# Altium project TK90X.PrjPcb
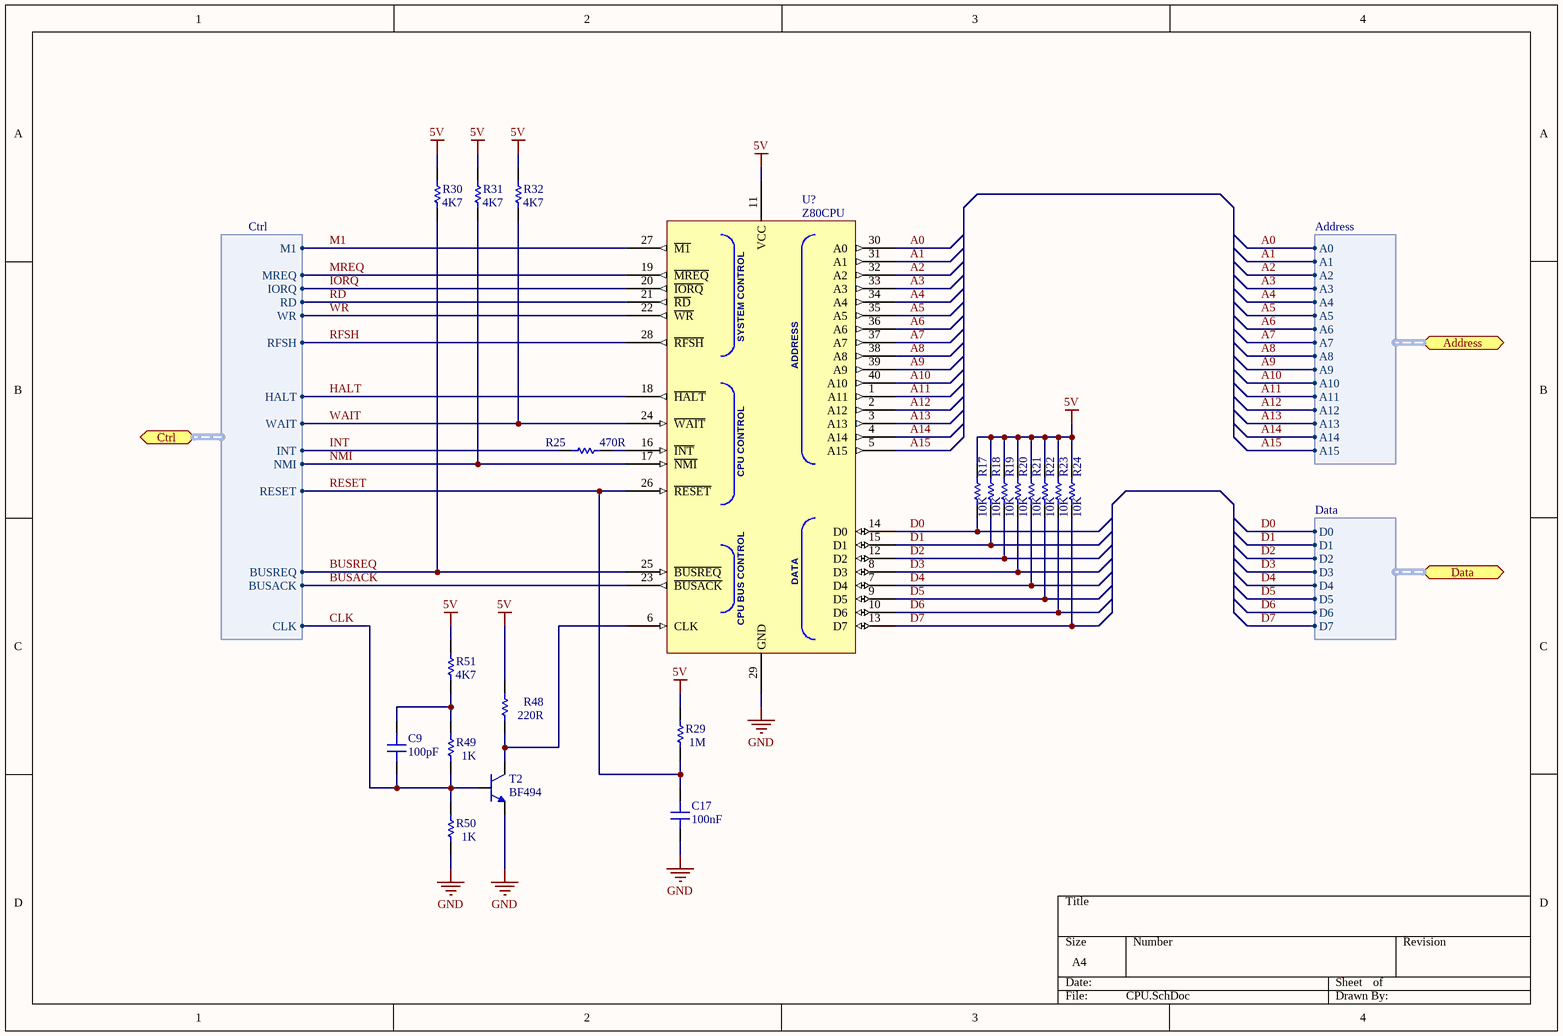
[diagram p0: CPU.SchDoc]
7 sheets, 62 parts. Net scope: flat (ports and power ports of the same name join across sheets).
Sheets:
  CPU.SchDoc
  Fonte.SchDoc
  RAM.SchDoc
  ROM.SchDoc
  ULA.SchDoc
  Video.SchDoc
  MuxAddr_RAM.SchDoc

## Sheet CPU.SchDoc
size A4

### Parts
C9  100pF  [DiskCapacitor]
C17  100nF  [DiskCapacitor]
R17  10K  [CR25]
R18  10K  [CR25]
R19  10K  [CR25]
R20  10K  [CR25]
R21  10K  [CR25]
R22  10K  [CR25]
R23  10K  [CR25]
R24  10K  [CR25]
R25  470R  [CR25]
R29  1M  [CR25]
R30  4K7  [CR25]
R31  4K7  [CR25]
R32  4K7  [CR25]
R48  220R  [CR25]
R49  1K  [CR25]
R50  1K  [CR25]
R51  4K7  [CR25]
T2  BF494  [TO-92]
U?  Z80CPU  [Z84C00xxPEG]

### Ports
Address (harness Address), Ctrl (harness Ctrl), Data (harness Data)

### Harnesses
Ctrl: M1, MREQ, IORQ, RD, WR, RFSH, HALT, WAIT, INT, NMI, RESET, BUSREQ, BUSACK, CLK
Address: A0, A1, A2, A3, A4, A5, A6, A7, A8, A9, A10, A11, A12, A13, A14, A15
Data: D0, D1, D2, D3, D4, D5, D6, D7

### Nets
5V: R17.2 R18.2 R19.2 R20.2 R21.2 R22.2 R23.2 R24.2 R29.2 R30.2 R31.2 R32.2 R48.2 R51.2 U?.11(VCC)
GND: C17.1 R50.1 T2.2 U?.29(GND)
A0: U?.30(A0) ; port Address.A0
A1: U?.31(A1) ; port Address.A1
A2: U?.32(A2) ; port Address.A2
A3: U?.33(A3) ; port Address.A3
A4: U?.34(A4) ; port Address.A4
A5: U?.35(A5) ; port Address.A5
A6: U?.36(A6) ; port Address.A6
A7: U?.37(A7) ; port Address.A7
A8: U?.38(A8) ; port Address.A8
A9: U?.39(A9) ; port Address.A9
A10: U?.40(A10) ; port Address.A10
A11: U?.1(A11) ; port Address.A11
A12: U?.2(A12) ; port Address.A12
A13: U?.3(A13) ; port Address.A13
A14: U?.4(A14) ; port Address.A14
A15: U?.5(A15) ; port Address.A15
BUSACK: U?.23(~{BUSACK}) ; port Ctrl.BUSACK
BUSREQ: R30.1 U?.25(~{BUSREQ}) ; port Ctrl.BUSREQ
CLK: C9.1 R49.1 R50.2 T2.1 ; port Ctrl.CLK
D0: R17.1 U?.14(D0) ; port Data.D0
D1: R18.1 U?.15(D1) ; port Data.D1
D2: R19.1 U?.12(D2) ; port Data.D2
D3: R20.1 U?.8(D3) ; port Data.D3
D4: R21.1 U?.7(D4) ; port Data.D4
D5: R22.1 U?.9(D5) ; port Data.D5
D6: R23.1 U?.10(D6) ; port Data.D6
D7: R24.1 U?.13(D7) ; port Data.D7
HALT: U?.18(~{HALT}) ; port Ctrl.HALT
INT: R25.1 ; port Ctrl.INT
IORQ: U?.20(~{IORQ}) ; port Ctrl.IORQ
M1: U?.27(~{M1}) ; port Ctrl.M1
MREQ: U?.19(~{MREQ}) ; port Ctrl.MREQ
NMI: R31.1 U?.17(~{NMI}) ; port Ctrl.NMI
RD: U?.21(~{RD}) ; port Ctrl.RD
RESET: C17.2 R29.1 U?.26(~{RESET}) ; port Ctrl.RESET
RFSH: U?.28(~{RFSH}) ; port Ctrl.RFSH
WAIT: R32.1 U?.24(~{WAIT}) ; port Ctrl.WAIT
WR: U?.22(~{WR}) ; port Ctrl.WR
NetC9_2: C9.2 R49.2 R51.1
NetR25_2: R25.2 U?.16(~{INT})
NetR48_1: R48.1 T2.3 U?.6(CLK)

### Notes on the sheet
- (in symbol Z84C00xxPEG) SYSTEM CONTROL; ADDRESS; CPU CONTROL; DATA; CPU BUS CONTROL

### Library data of the parts
C9 C17 = Capacitor
R17-R25 R29-R32 R48-R51 = Resistor
T2 = BF494: NPN Medium Frequency Transistors
U? = Z84C00xxPEG: Z80 - CPU

## Sheet Fonte.SchDoc
size A4
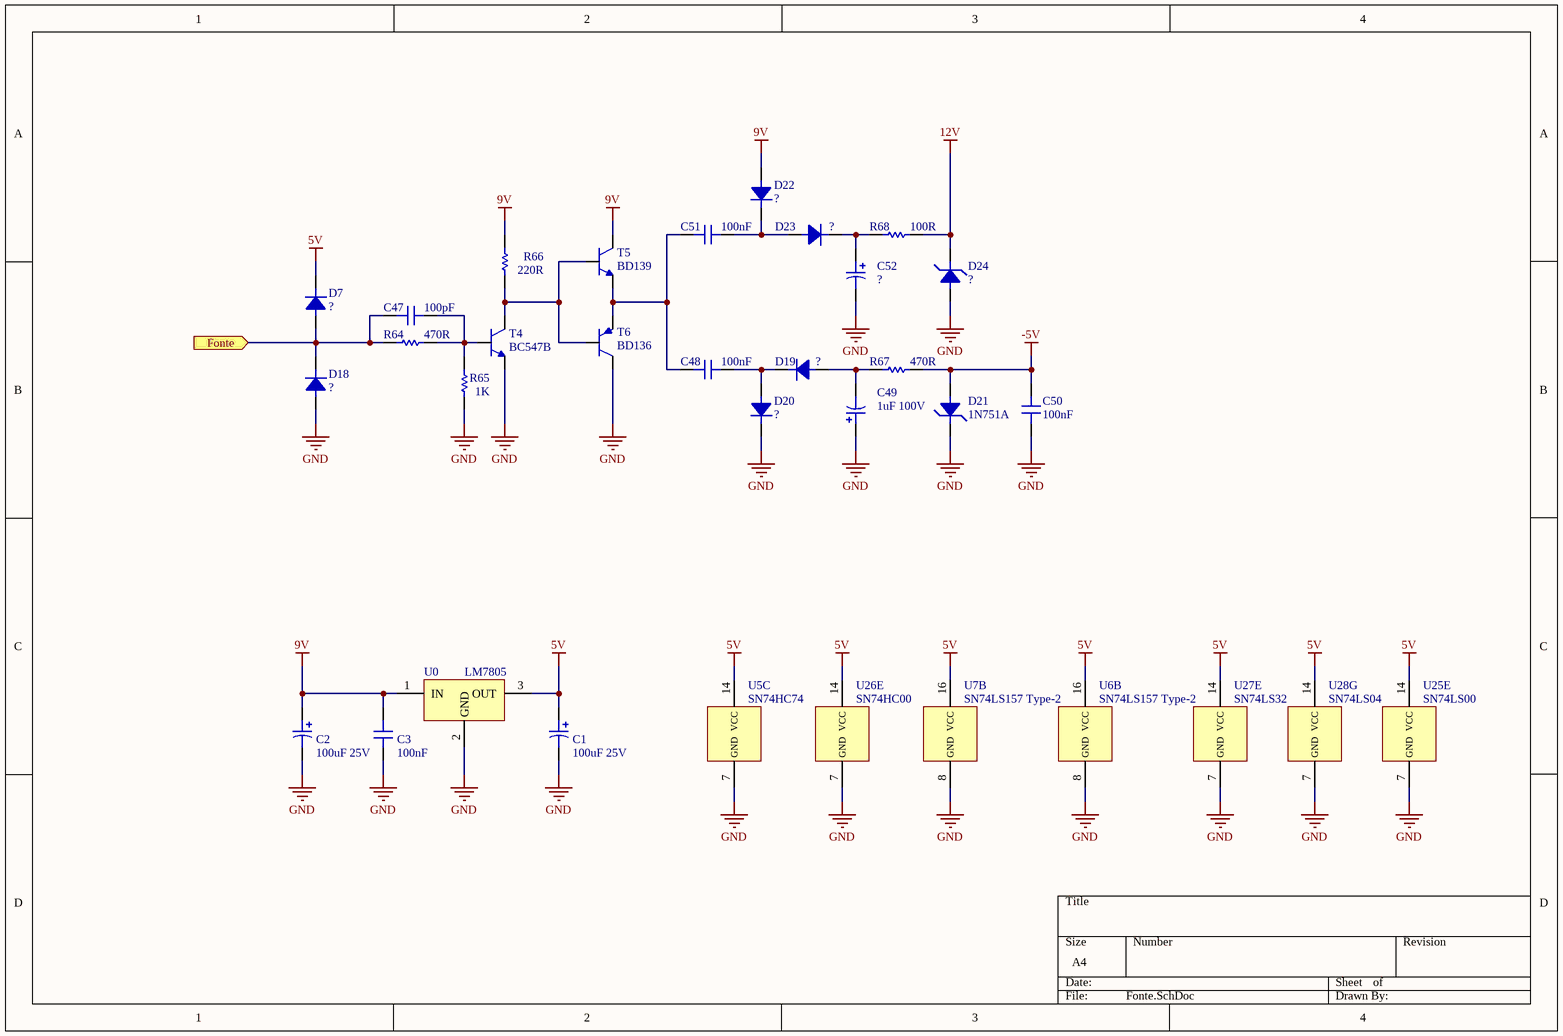
[diagram p1: Fonte.SchDoc]

### Parts
C1  100uF 25V  [ECA 6.3x11.2]
C2  100uF 25V  [ECA 6.3x11.2]
C3  100nF  [DiskCapacitor]
C47  100pF  [DiskCapacitor]
C48  100nF  [DiskCapacitor]
C49  1uF 100V  [ECA 5x11]
C50  100nF  [DiskCapacitor]
C51  100nF  [DiskCapacitor]
C52  ?  [ECA 5x11]
D7  ?  [DO-15]
D18  ?  [DO-15]
D19  ?  [DO-15]
D20  ?  [DO-15]
D21  1N751A  [DO-15]
D22  ?  [DO-15]
D23  ?  [DO-15]
D24  ?  [DO-15]
R64  470R  [CR25]
R65  1K  [CR25]
R66  220R  [CR25]
R67  470R  [CR25]
R68  100R  [CR25]
T4  BC547B  [TO-92]
T5  BD139  [TO-126]
T6  BD136  [TO-126]
U0  LM7805  [TO-220]
U5  SN74HC74  [TSSOP14]  (part C of 3)
U6  SN74LS157 Type-2  [TSSOP16]  (part B of 2)
U7  SN74LS157 Type-2  [TSSOP16]  (part B of 2)
U25  SN74LS00  [TSSOP14]  (part E of 5)
U26  SN74HC00  [TSSOP14]  (part E of 5)
U27  SN74LS32  [TSSOP14]  (part E of 5)
U28  SN74LS04  [CDIP14]  (part G of 7)

### Ports
Fonte (in)

### Nets
5V: C1.1 D7.1 U0.3(OUT) U5.14(VCC) U6.16(VCC) U7.16(VCC) U25.14(VCC) U26.14(VCC) U27.14(VCC) U28.14(VCC)
9V: C2.1 C3.2 D22.2 R66.2 T5.2 U0.1(IN)
12V: D24.1 R68.1
-5V: C50.1 D21.2 R67.1
GND: C1.2 C2.2 C3.1 C49.1 C50.2 C52.2 D18.2 D20.1 D21.1 D24.2 R65.1 T4.1 T6.2 U0.2(GND) U5.7(GND) U6.8(GND) U7.8(GND) U25.7(GND) U26.7(GND) U27.7(GND) U28.7(GND)
NetC47_1: C47.1 R64.1 R65.2 T4.2
NetC47_2: C47.2 D7.2 D18.1 R64.2 ; port Fonte
NetC48_1: C48.1 D19.1 D20.2
NetC48_2: C48.2 C51.2 T5.1 T6.1
NetC49_2: C49.2 D19.2 R67.2
NetC51_1: C51.1 D22.1 D23.2
NetC52_1: C52.1 D23.1 R68.2
NetR66_1: R66.1 T4.3 T5.3 T6.3

### Library data of the parts
C1 C2 = ECA1EM101
C3 C47 C48 C50 C51 = Capacitor
C49 = ECA2AM2R2
C52 = ECA1CM100
D7 D18-D20 D22 D23 = Diode
D21 = Diode Zener: 5V1 500mW
D24 = Diode Zener
R64-R68 = Resistor
T4 = BC546_47_48_49_50: NPN Epitaxial Silicon Transistor
T5 = BD135_37_39: NPN Epitaxial Silicon Transistor
T6 = BD136_38_40: PNP Epitaxial Silicon Transistor
U0 = LM7805: LM7805 - Positive Voltage Regulator
U5 = SN74HC74: Dual D-Type Positive-Edge-Triggered Flip-Flops With Clear and Preset
U6 U7 = SN74HC157 Type-2: Quadruple 2-Line To 1-Line Data Selectors/Mutiplexers
U25 U26 = SN74HC00: Quadruple 2-Input Positive-NAND Gates
U27 = SN74HC32: Quadruple 2-Input Positive-OR Gates
U28 = SN74HC04: Hex Inverters

## Sheet RAM.SchDoc
size A4

## Sheet ROM.SchDoc
size A4

## Sheet ULA.SchDoc
size A4
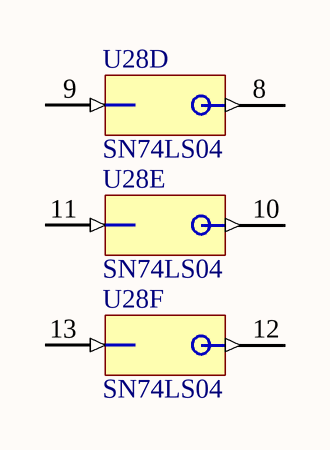
[diagram p2: ULA.SchDoc]

### Parts
U28  SN74LS04  [CDIP14]  (parts D,E,F of 7)

### Nets

Not connected (* = marked no-connect by the designer): U28 8(Y) 9(A) 10(Y) 11(A) 12(Y) 13(A)

### Library data of the parts
U28 = SN74HC04: Hex Inverters

## Sheet Video.SchDoc
size A4
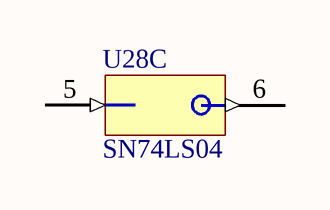
[diagram p3: Video.SchDoc]

### Parts
U28  SN74LS04  [CDIP14]  (part C of 7)

### Nets

Not connected (* = marked no-connect by the designer): U28 5(A) 6(Y)

### Library data of the parts
U28 = SN74HC04: Hex Inverters

## Sheet MuxAddr_RAM.SchDoc
size A4
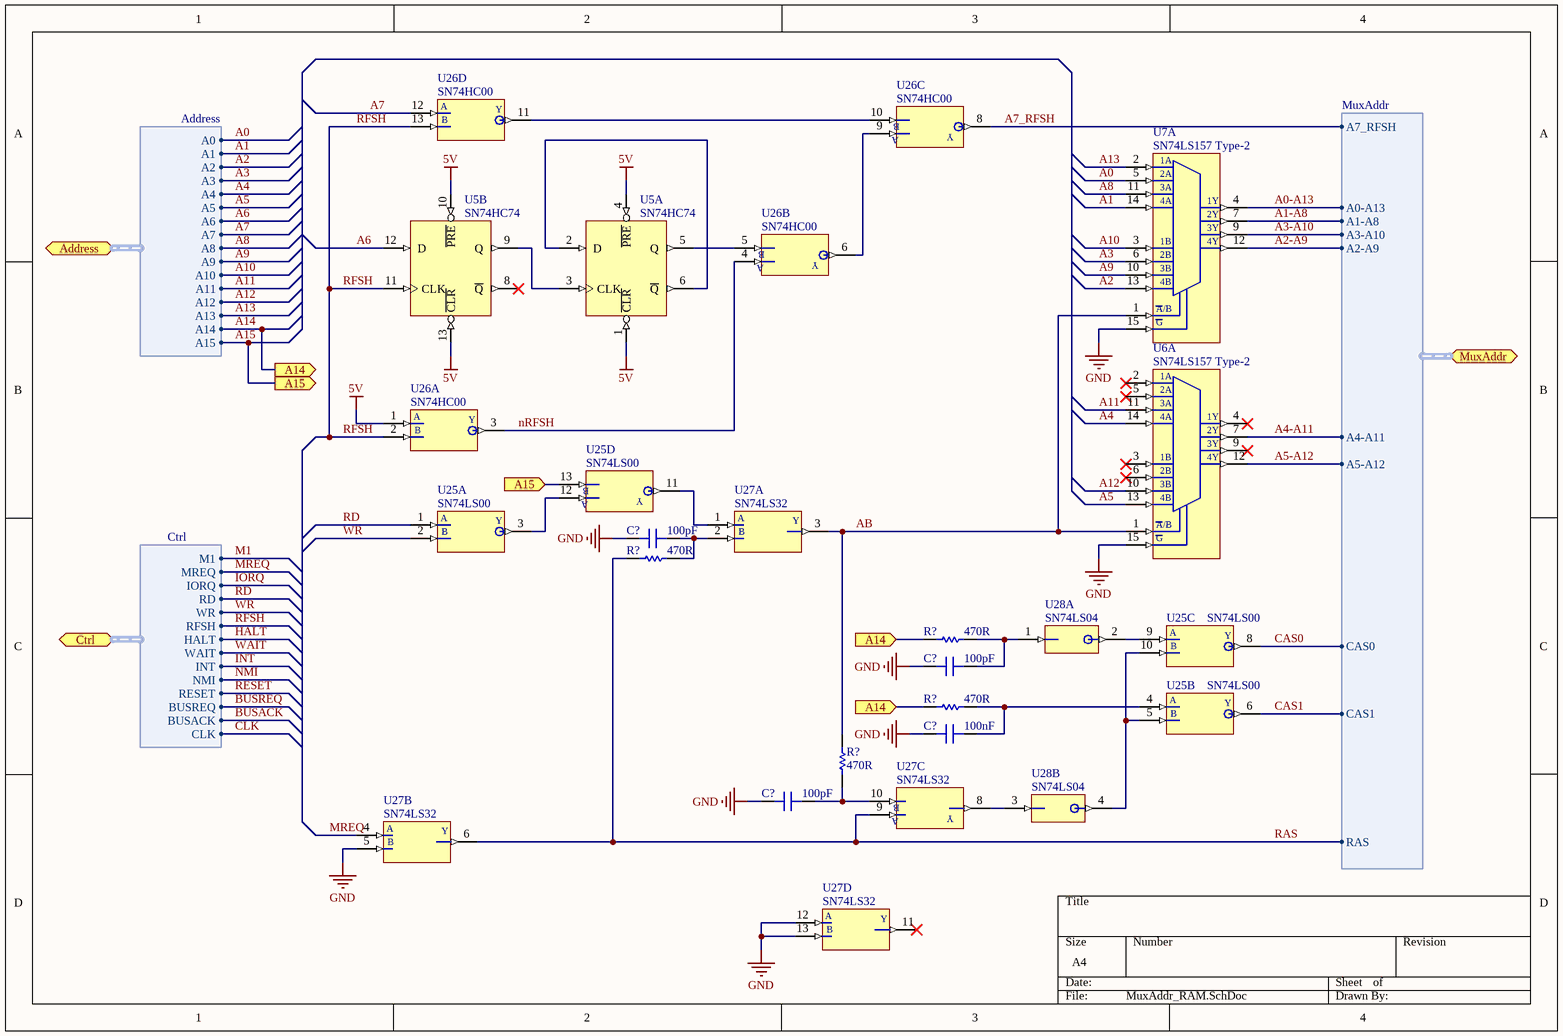
[diagram p4: MuxAddr_RAM.SchDoc]

### Parts
(Parts that share a designator on the sheet are numbered #1, #2 ... from top to bottom, then left to right.)
C?#1  100pF  [DiskCapacitor]
C?#2  100pF  [DiskCapacitor]
C?#3  100nF  [DiskCapacitor]
C?#4  100pF  [DiskCapacitor]
R?#1  470R  [CR25]
R?#2  470R  [CR25]
R?#3  470R  [CR25]
R?#4  470R  [CR25]
U5  SN74HC74  [TSSOP14]  (parts A,B of 3)
U6  SN74LS157 Type-2  [PDIP16]  (part A of 2)
U7  SN74LS157 Type-2  [PDIP16]  (part A of 2)
U25  SN74LS00  [TSSOP14]  (parts A,B,C,D of 5)
U26  SN74HC00  [TSSOP14]  (parts A,B,C,D of 5)
U27  SN74LS32  [CDIP14]  (parts A,B,C,D of 5)
U28  SN74LS04  [CDIP14]  (parts A,B of 7)

### Ports
A14 (in), A14 (out), A15 (in), A15 (out), Address (harness Address), Ctrl (harness Ctrl), MuxAddr (harness MuxAddr)

### Harnesses
Address: A0, A1, A2, A3, A4, A5, A6, A7, A8, A9, A10, A11, A12, A13, A14, A15
Ctrl: M1, MREQ, IORQ, RD, WR, RFSH, HALT, WAIT, INT, NMI, RESET, BUSREQ, BUSACK, CLK
MuxAddr: A0-A13, A1-A8, A3-A10, A2-A9, A4-A11, A5-A12, A7_RFSH, RAS, CAS0, CAS1

### Nets
5V: U5.1(~{CLR}) U5.4(~{PRE}) U5.10(~{PRE}) U5.13(~{CLR}) U26.1(A)
GND: C?#1.1 C?#2.1 C?#3.1 C?#4.1 U6.15(G) U7.15(G) U27.5(B) U27.12(A) U27.13(B)
A0: U7.5(2A) ; port Address.A0
A0-A13: U7.4(1Y) ; port MuxAddr.A0-A13
A1: U7.14(4A) ; port Address.A1
A1-A8: U7.7(2Y) ; port MuxAddr.A1-A8
A2: U7.13(4B) ; port Address.A2
A2-A9: U7.12(4Y) ; port MuxAddr.A2-A9
A3: U7.6(2B) ; port Address.A3
A3-A10: U7.9(3Y) ; port MuxAddr.A3-A10
A4: U6.14(4A) ; port Address.A4
A4-A11: U6.7(2Y) ; port MuxAddr.A4-A11
A5: U6.13(4B) ; port Address.A5
A5-A12: U6.12(4Y) ; port MuxAddr.A5-A12
A6: U5.12(D) ; port Address.A6
A7: U26.12(A) ; port Address.A7
A7_RFSH: U26.8(Y) ; port MuxAddr.A7_RFSH
A8: U7.11(3A) ; port Address.A8
A9: U7.10(3B) ; port Address.A9
A10: U7.3(1B) ; port Address.A10
A11: U6.11(3A) ; port Address.A11
A12: U6.10(3B) ; port Address.A12
A13: U7.2(1A) ; port Address.A13
A14: R?#2.2 R?#3.2 ; port A14, port Address.A14
A15: U25.13(B) ; port A15, port Address.A15
AB: R?#4.1 U6.1(A/B) U7.1(A/B) U27.3(Y)
CAS0: U25.8(Y) ; port MuxAddr.CAS0
CAS1: U25.6(Y) ; port MuxAddr.CAS1
MREQ: U27.4(A) ; port Ctrl.MREQ
nRFSH: U26.3(Y) U26.4(A)
RAS: R?#1.2 U27.6(Y) U27.9(A) ; port MuxAddr.RAS
RD: U25.1(A) ; port Ctrl.RD
RFSH: U5.11(CLK) U26.2(B) U26.13(B) ; port Ctrl.RFSH
WR: U25.2(B) ; port Ctrl.WR
NetC?#1_2: C?#1.2 R?#1.1 U27.2(B)
NetC?#2_2: C?#2.2 R?#2.1 U28.1(A)
NetC?#3_2: C?#3.2 R?#3.1 U25.4(A)
NetC?#4_2: C?#4.2 R?#4.2 U27.10(B)
NetU5_2: U5.2(D) U5.6(~{Q})
NetU5_3: U5.3(CLK) U5.9(Q)
NetU5_5: U5.5(Q) U26.5(B)
NetU25_3: U25.3(Y) U25.12(A)
NetU25_5: U25.5(B) U25.10(B) U28.4(Y)
NetU25_9: U25.9(A) U28.2(Y)
NetU25_11: U25.11(Y) U27.1(A)
NetU26_6: U26.6(Y) U26.9(A)
NetU26_10: U26.10(B) U26.11(Y)
NetU27_8: U27.8(Y) U28.3(A)

Not connected (* = marked no-connect by the designer): U5 8(~{Q})*; U6 2(1A)* 3(1B)* 4(1Y)* 5(2A)* 6(2B)* 9(3Y)*; U27 11(Y)*

### Library data of the parts
C?#1 C?#2 C?#4 = Capacitor
C?#3 = Capacitor: 100pF
R?#1-R?#4 = Resistor
U5 = SN74HC74: as U5 on sheet Fonte
U6 U7 = SN74HC157 Type-2: as U6 on sheet Fonte
U25 U26 = SN74HC00: Quadruple 2-Input Positive-NAND Gates
U27 = SN74HC32: Quadruple 2-Input Positive-OR Gates
U28 = SN74HC04: Hex Inverters

## Nets that join several sheets
5V: CPU (15 pins), Fonte (10 pins), MuxAddr_RAM (5 pins)
GND: CPU (C17.1 R50.1 T2.2 U?.29), Fonte (21 pins), MuxAddr_RAM (9 pins)
A0: CPU (U?.30), MuxAddr_RAM (U7.5)
A1: CPU (U?.31), MuxAddr_RAM (U7.14)
A2: CPU (U?.32), MuxAddr_RAM (U7.13)
A3: CPU (U?.33), MuxAddr_RAM (U7.6)
A4: CPU (U?.34), MuxAddr_RAM (U6.14)
A5: CPU (U?.35), MuxAddr_RAM (U6.13)
A6: CPU (U?.36), MuxAddr_RAM (U5.12)
A7: CPU (U?.37), MuxAddr_RAM (U26.12)
A8: CPU (U?.38), MuxAddr_RAM (U7.11)
A9: CPU (U?.39), MuxAddr_RAM (U7.10)
A10: CPU (U?.40), MuxAddr_RAM (U7.3)
A11: CPU (U?.1), MuxAddr_RAM (U6.11)
A12: CPU (U?.2), MuxAddr_RAM (U6.10)
A13: CPU (U?.3), MuxAddr_RAM (U7.2)
A14: CPU (U?.4), MuxAddr_RAM (R?#2.2 R?#3.2)
A15: CPU (U?.5), MuxAddr_RAM (U25.13)
MREQ: CPU (U?.19), MuxAddr_RAM (U27.4)
RD: CPU (U?.21), MuxAddr_RAM (U25.1)
RFSH: CPU (U?.28), MuxAddr_RAM (U5.11 U26.2 U26.13)
WR: CPU (U?.22), MuxAddr_RAM (U25.2)